# Altium schematic sheet CONTROLADOR-V1-CPU.SchDoc
size A4
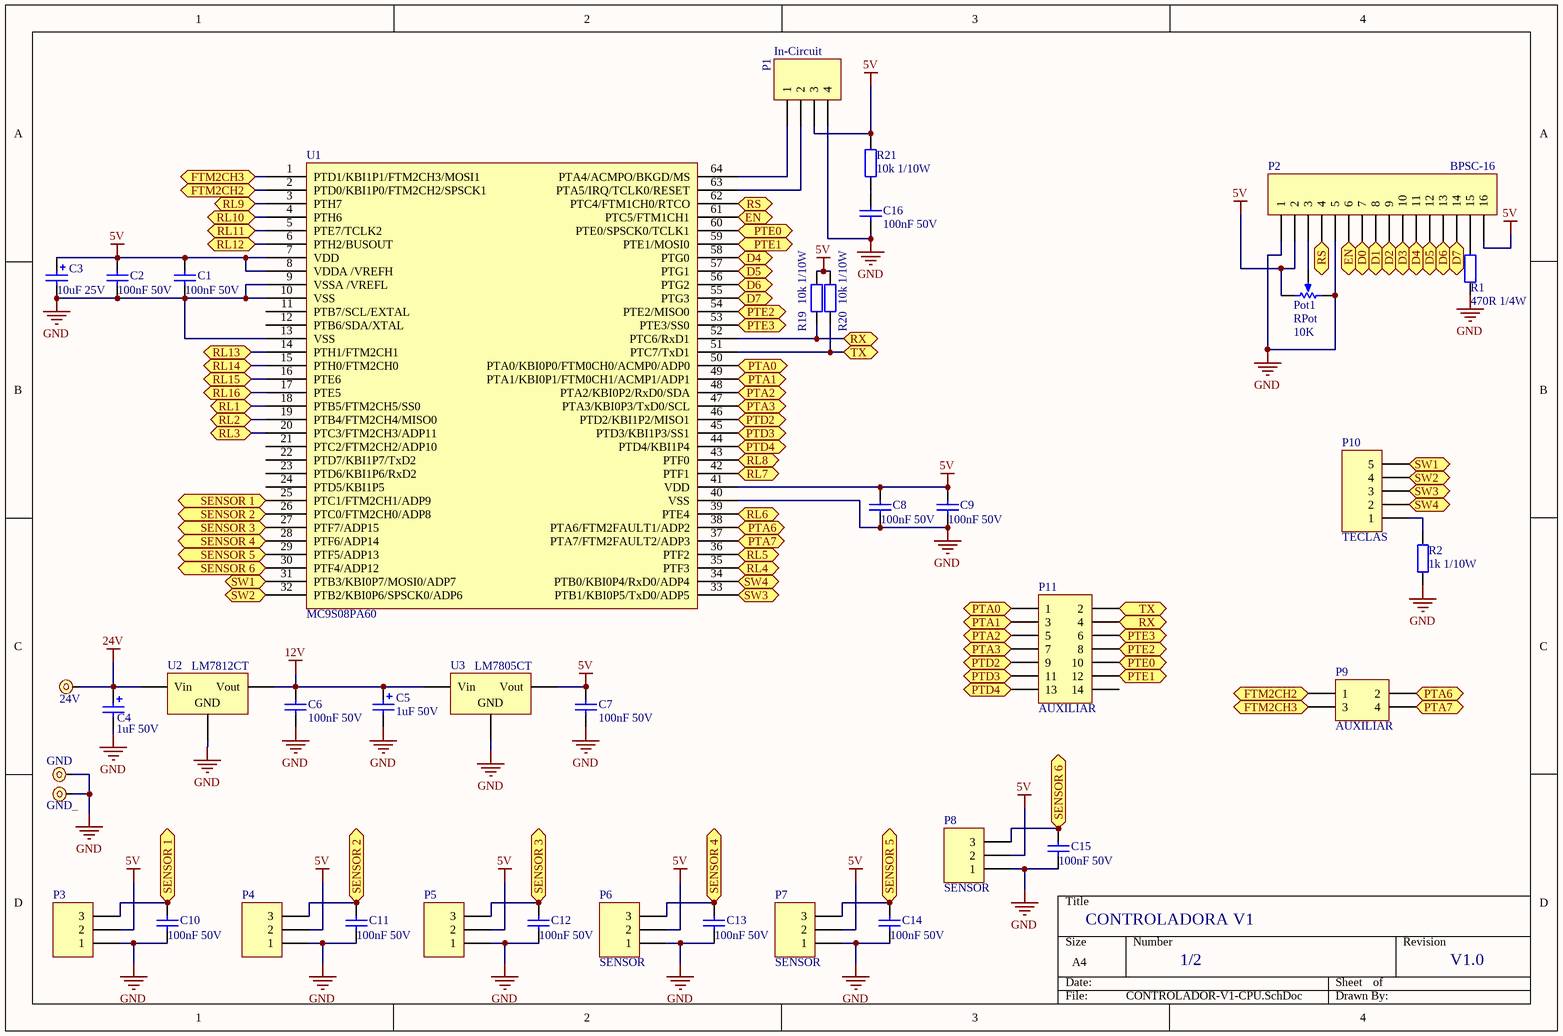
[diagram p0: CONTROLADOR-V1-CPU.SchDoc]

## Parts
24V  PAD 1.5x3mm  [PAD 1.5x3mm]  (value not drawn)  (no BOM)
C1  100nF 50V  [CAPC0603N]
C2  100nF 50V  [CAPC0603N]
C3  10uF 25V  [CAP_ELETR_4X5.4 SMD]
C4  1uF 50V  [CAP_ELETR_4X5.4 SMD]
C5  1uF 50V  [CAP_ELETR_4X5.4 SMD]
C6  100nF 50V  [CAPC0603N]
C7  100nF 50V  [CAPC0603N]
C8  100nF 50V  [CAPC0603N]
C9  100nF 50V  [CAPC0603N]
C10  100nF 50V  [CAPC0603N]
C11  100nF 50V  [CAPC0603N]
C12  100nF 50V  [CAPC0603N]
C13  100nF 50V  [CAPC0603N]
C14  100nF 50V  [CAPC0603N]
C15  100nF 50V  [CAPC0603N]
C16  100nF 50V  [CAPC0603N]
GND  PAD 1.5x3mm  [PAD 1.5x3mm]  (value not drawn)  (no BOM)
GND_  PAD 1.5x3mm  [PAD 1.5x3mm]  (value not drawn)  (no BOM)
P1  In-Circuit  [HEADER 4X2.54MM]
P2  BPSC-16  [BPSC-16]
P3  SENSOR  [HEADER 3X2.54MM]  (value not drawn)
P4  SENSOR  [HEADER 3X2.54MM]  (value not drawn)
P5  SENSOR  [HEADER 3X2.54MM]  (value not drawn)
P6  SENSOR  [HEADER 3X2.54MM]
P7  SENSOR  [HEADER 3X2.54MM]
P8  SENSOR  [HEADER 3X2.54MM]
P9  AUXILIAR  [HDR2X2]
P10  TECLAS  [BPSC-5]
P11  AUXILIAR  [HDR2X7]
Pot1  RPot  value 10K  [VR5]
R1  470R 1/4W  [RESC1206N]
R2  1k 1/10W  [RESC0603N]
R19  10k 1/10W  [RESC0603N]
R20  10k 1/10W  [RESC0603N]
R21  10k 1/10W  [RESC0603N]
U1  MC9S08PA60  [LQFP64]
U2  LM7812CT  [TO220_90]
U3  LM7805CT  [TO220_90]

## Ports
D0, D1, D2, D3, D4, D5, D6, D7, EN, FTM2CH2, FTM2CH3, PTA0, PTA1, PTA2, PTA3, PTA6, PTA7, PTD2, PTD3, PTD4, PTE0, PTE1, PTE2, PTE3, RL1, RL2, RL3, RL4, RL5, RL6, RL7, RL8, RL9, RL10, RL11, RL12, RL13, RL14, RL15, RL16, RS, RX, SENSOR 1, SENSOR 2, SENSOR 3, SENSOR 4, SENSOR 5, SENSOR 6, SW1, SW2, SW3, SW4, TX

## Nets
5V: C1.2 C2.2 C3.1 C7.2 C8.2 C9.2 P1.3 P2.2 P2.16 P3.2 P4.2 P5.2 P6.2 P7.2 P8.2 Pot1.2(BOT) R19.1 R20.1 R21.2 U1.7(VDD) U1.8(VDDA_/VREFH) U1.41(VDD) U3.3(Vout)
12V: C5.1 C6.2 U2.3(Vout) U3.1(Vin)
24V: 24V.1 C4.1 U2.1(Vin)
GND: C1.1 C2.1 C3.2 C4.2 C5.2 C6.1 C7.1 C8.1 C9.1 C10.1 C11.1 C12.1 C13.1 C14.1 C15.1 C16.2 GND.1 GND_.1 P1.4 P2.1 P2.5 P3.1 P4.1 P5.1 P6.1 P7.1 P8.1 Pot1.1(TOP) R1.1 R2.1 U1.9(VSSA_/VREFL) U1.10(VSS) U1.13(VSS) U1.40(VSS) U2.2(GND) U3.2(GND)
D0: P2.7 ; port D0
D1: P2.8 ; port D1
D2: P2.9 ; port D2
D3: P2.10 ; port D3
D4: P2.11 U1.58(PTG0) ; port D4
D5: P2.12 U1.57(PTG1) ; port D5
D6: P2.13 U1.56(PTG2) ; port D6
D7: P2.14 U1.55(PTG3) ; port D7
EN: P2.6 U1.61(PTC5/FTM1CH1) ; port EN
FTM2CH2: P9.1 U1.2(PTD0/KBI1P0/FTM2CH2/SPSCK1) ; port FTM2CH2
FTM2CH3: P9.3 U1.1(PTD1/KBI1P1/FTM2CH3/MOSI1) ; port FTM2CH3
PTA0: P11.1 U1.50(PTA0/KBI0P0/FTM0CH0/ACMP0/ADP0) ; port PTA0
PTA1: P11.3 U1.49(PTA1/KBI0P1/FTM0CH1/ACMP1/ADP1) ; port PTA1
PTA2: P11.5 U1.48(PTA2/KBI0P2/RxD0/SDA) ; port PTA2
PTA3: P11.7 U1.47(PTA3/KBI0P3/TxD0/SCL) ; port PTA3
PTA6: P9.2 U1.38(PTA6/FTM2FAULT1/ADP2) ; port PTA6
PTA7: P9.4 U1.37(PTA7/FTM2FAULT2/ADP3) ; port PTA7
PTD2: P11.9 U1.46(PTD2/KBI1P2/MISO1) ; port PTD2
PTD3: P11.11 U1.45(PTD3/KBI1P3/SS1) ; port PTD3
PTD4: P11.13 U1.44(PTD4/KBI1P4) ; port PTD4
PTE0: P11.10 U1.60(PTE0/SPSCK0/TCLK1) ; port PTE0
PTE1: P11.12 U1.59(PTE1/MOSI0) ; port PTE1
PTE2: P11.8 U1.54(PTE2/MISO0) ; port PTE2
PTE3: P11.6 U1.53(PTE3/SS0) ; port PTE3
RL1: U1.18(PTB5/FTM2CH5/SS0) ; port RL1
RL2: U1.19(PTB4/FTM2CH4/MISO0) ; port RL2
RL3: U1.20(PTC3/FTM2CH3/ADP11) ; port RL3
RL4: U1.35(PTF3) ; port RL4
RL5: U1.36(PTF2) ; port RL5
RL6: U1.39(PTE4) ; port RL6
RL7: U1.42(PTF1) ; port RL7
RL8: U1.43(PTF0) ; port RL8
RL9: U1.3(PTH7) ; port RL9
RL10: U1.4(PTH6) ; port RL10
RL11: U1.5(PTE7/TCLK2) ; port RL11
RL12: U1.6(PTH2/BUSOUT) ; port RL12
RL13: U1.14(PTH1/FTM2CH1) ; port RL13
RL14: U1.15(PTH0/FTM2CH0) ; port RL14
RL15: U1.16(PTE6) ; port RL15
RL16: U1.17(PTE5) ; port RL16
RS: P2.4 U1.62(PTC4/FTM1CH0/RTCO) ; port RS
RX: P11.4 R19.2 U1.52(PTC6/RxD1) ; port RX
SENSOR 1: C10.2 P3.3 U1.25(PTC1/FTM2CH1/ADP9) ; port SENSOR 1
SENSOR 2: C11.2 P4.3 U1.26(PTC0/FTM2CH0/ADP8) ; port SENSOR 2
SENSOR 3: C12.2 P5.3 U1.27(PTF7/ADP15) ; port SENSOR 3
SENSOR 4: C13.2 P6.3 U1.28(PTF6/ADP14) ; port SENSOR 4
SENSOR 5: C14.2 P7.3 U1.29(PTF5/ADP13) ; port SENSOR 5
SENSOR 6: C15.2 P8.3 U1.30(PTF4/ADP12) ; port SENSOR 6
SW1: P10.5 U1.31(PTB3/KBI0P7/MOSI0/ADP7) ; port SW1
SW2: P10.4 U1.32(PTB2/KBI0P6/SPSCK0/ADP6) ; port SW2
SW3: P10.3 U1.33(PTB1/KBI0P5/TxD0/ADP5) ; port SW3
SW4: P10.2 U1.34(PTB0/KBI0P4/RxD0/ADP4) ; port SW4
TX: P11.2 R20.2 U1.51(PTC7/TxD1) ; port TX
NetC16_1: C16.1 R21.1
NetP1_1: P1.1 U1.64(PTA4/ACMPO/BKGD/MS)
NetP1_2: P1.2 U1.63(PTA5/IRQ/TCLK0/RESET)
NetP2_3: P2.3 Pot1.3(TAP)
NetP2_15: P2.15 R1.2
NetP10_1: P10.1 R2.2

Not connected (* = marked no-connect by the designer): P11 14; U1 11(PTB7/SCL/EXTAL) 12(PTB6/SDA/XTAL) 21(PTC2/FTM2CH2/ADP10) 22(PTD7/KBI1P7/TxD2) 23(PTD6/KBI1P6/RxD2) 24(PTD5/KBI1P5)

## Notes on the sheet
- CONTROLADORA V1
- 1/2
- V1.0

## Library data of the parts
24V GND GND_ = PAD 1.5x3mm: PAD
C1 C2 C6-C16 = Cap 100nF 50V 0603: CAP CER 0.1UF 50V X7R 0603; Manufacturer: Samsung Electro-Mechanics America, Inc.; Manufacturer Part Number: CL10B104KB8NNNC; Código: 1766; Montagem: SMD; Tolerance: ±10%; Supplier 1: Digi-Key; Supplier Part Number 1: 1276-1000-1-ND; RoHS: RoHS Compliant; Category: Capacitors; Stock 1: 3548129; Pricing 1: 1=0.1, 10=0.027, 100=0.0122, 500=0.00874, 1000=0.00687 (USD); Packaging: Cut Tape (CT); Part Status: Active; Voltage - Rated: 50V; Temperature Coefficient: X7R; Operating Temperature: -55°C ~ 125°C; Features: -; Ratings: -; Applications: General Purpose; Mounting Type: Surface Mount, MLCC; Package / Case: 0603 (1608 Metric); Size / Dimension: 0.063" L x 0.032" W (1.60mm x 0.80mm); Height - Seated (Max): -; Thickness (Max): 0.035" (0.90mm); Lead Spacing: -; Lead Style: -; ComponentLink1URL: http://media.digikey.com/pdf/Data%20Sheets/Samsung%20PDFs/CL_Series_MLCC_ds.pdf; ComponentLink1Description: http://media.digikey.com/pdf/Data%20Sheets/Samsung%20PDFs/CL_Series_MLCC_ds.pdf
C3 = Cap Eletrolitico 10uF 25V: CAP ALUM 10UF 20% 25V SMD; Manufacturer: Panasonic Electronic Components; Manufacturer Part Number: EEE-1EA100WR; Código: 2170; Lifetime @ Temp.: 1000 Hrs @ 85°C; Polarization: Polar; Ripple Current - Low Frequency: 22mA @ 120Hz; Ripple Current - High Frequency: 37.4mA @ 10kHz; Surface Mount Land Size: 0.169" L x 0.169" W (4.30mm x 4.30mm); Montagem: SMD; Supplier 1: Digi-Key; Supplier Part Number 1: PCE3895CT-ND; RoHS: RoHS Compliant; Category: Capacitors; Stock 1: 101827; Pricing 1: 1=0.31, 10=0.21, 100=0.1191, 500=0.08404, 1000=0.07354 (USD); Packaging: Cut Tape (CT); Part Status: Active; Tolerance: ±20%; ESR (Equivalent Series Resistance): -; Operating Temperature: -40°C ~ 85°C; Applications: General Purpose; Lead Spacing: -; Size / Dimension: 0.157" Dia (4.00mm); Height - Seated (Max): 0.213" (5.40mm); Mounting Type: Surface Mount; Package / Case: Radial, Can - SMD; ComponentLink1URL: https://industrial.panasonic.com/cdbs/www-data/pdf/RDE0000/ABA0000C1145.pdf; ComponentLink1Description: https://industrial.panasonic.com/cdbs/www-data/pdf/RDE0000/ABA0000C1145.pdf
C4 C5 = Cap Eletrolitico 1uF 50V: CAP ALUM 1UF 20% 50V SMD; Manufacturer: Panasonic Electronic Components; Manufacturer Part Number: EEE-HA1H1R0R; Lifetime @ Temp.: 1000 Hrs @ 105°C; Polarization: Polar; Ripple Current - Low Frequency: 10mA @ 120Hz; Ripple Current - High Frequency: 17mA @ 10kHz; Surface Mount Land Size: 0.169" L x 0.169" W (4.30mm x 4.30mm); Montagem: SMD; Supplier 1: Digi-Key; Supplier Part Number 1: PCE4212CT-ND; RoHS: RoHS Compliant; Category: Capacitors; Stock 1: 21464; Pricing 1: 1=0.32, 10=0.217, 100=0.1232, 500=0.08694, 1000=0.07607 (USD); Packaging: Cut Tape (CT); Part Status: Active; Tolerance: ±20%; ESR (Equivalent Series Resistance): -; Operating Temperature: -40°C ~ 105°C; Applications: Automotive; Lead Spacing: -; Size / Dimension: 0.157" Dia (4.00mm); Height - Seated (Max): 0.213" (5.40mm); Mounting Type: Surface Mount; Package / Case: Radial, Can - SMD; ComponentLink1URL: https://industrial.panasonic.com/cdbs/www-data/pdf/RDE0000/ABA0000C1151.pdf; ComponentLink1Description: https://industrial.panasonic.com/cdbs/www-data/pdf/RDE0000/ABA0000C1151.pdf
P1 = Barra de pinos simples 180°, 4 pinos: CONN HEADER 4 POS 2.54; Manufacturer: Metaltex; Manufacturer Part Number: BPSC-4; Código: 2308; Montagem: PTH; Pitch - Mating: 0.100" (2.54mm); Style: Board to Board or Cable; Shrouding: Unshrouded; Number of Positions: 4; Number of Positions Loaded: All; Contact Length - Mating: 0.236" (6.00mm); Contact Length - Post: 0.118" (3.00mm); Overall Contact Length: 0.454" (11.54mm); Material Flammability Rating: UL94 V-0; Current Rating: 3A; Voltage Rating: 250V; Supplier 1: Digi-Key; Supplier Part Number 1: 732-5317-ND; RoHS: RoHS Compliant; Category: Connectors, Interconnects; Stock 1: 2640; Pricing 1: 1=0.18, 10=0.153, 25=0.1272, 50=0.106, 100=0.096, 1000=0.088 (USD); Packaging: Bulk; Part Status: Active; Connector Type: Header; Contact Type: Male Pin; Number of Rows: 1; Row Spacing - Mating: -; Mounting Type: Through Hole; Termination: Solder; Fastening Type: Push-Pull; Insulation Height: 0.100" (2.54mm); Contact Shape: Square; Contact Finish - Mating: Gold; Contact Finish Thickness - Mating: -; Contact Finish - Post: -; Contact Material: Copper Alloy; Insulation Material: Polybutylene Terephthalate (PBT); Features: -; Operating Temperature: -40°C ~ 125°C; Ingress Protection: -; Insulation Color: Black; Mated Stacking Heights: -; Contact Finish Thickness - Post: -; Applications: -; ComponentLink1URL: http://www.metaltex.com.br/produtos/componentes/4091/conectores_para_pci/4094/bp_barra_de_pinos; ComponentLink1Description: http://www.metaltex.com.br/produtos/componentes/4091/conectores_para_pci/4094/bp_barra_de_pinos
P2 = Barra de pinos simples 180º, 16 pinos: CONN HEADER 16POS 2.54MM VERT; Manufacturer: Molex Inc; Manufacturer Part Number: 0022284160; Connector Type: Header, Unshrouded, Breakaway; Number of Positions: 16; Number of Positions Loaded: All; Pitch: 0.100" (2.54mm); Supplier 1: Digi-Key; Supplier Part Number 1: WM50014-16-ND; RoHS: RoHS Compliant; Category: Connectors, Interconnects; Stock 1: 0; Pricing 1: 1=0.52, 10=0.461, 100=0.3797, 500=0.30012, 1000=0.25763, 5000=0.23503, 10000=0.22599 (USD); Packaging: Bulk; Contact Type: Male Pin; Number of Rows: 1; Row Spacing: -; Contact Mating Length: 0.240" (6.10mm); Mounting Type: Through Hole; Termination: Solder; Fastening Type: -; Features: -; Contact Finish: Tin; Contact Finish Thickness: 100µin (2.54µm); Color: Black; ComponentLink1URL: http://www.molex.com/pdm_docs/sd/022284160_sd.pdf; ComponentLink1Description: http://www.molex.com/pdm_docs/sd/022284160_sd.pdf
P3-P8 = Barra de pinos simples 180°, 3 pinos: CONN HEADER 3 POS 2.54; Manufacturer: Metaltex; Manufacturer Part Number: BPSC-3; Código: 2307; Montagem: PTH; Pitch - Mating: 0.100" (2.54mm); Style: Board to Board or Cable; Shrouding: Unshrouded; Number of Positions: 3; Number of Positions Loaded: All; Contact Length - Mating: 0.236" (6.00mm); Contact Length - Post: 0.118" (3.00mm); Overall Contact Length: 0.454" (11.54mm); Material Flammability Rating: UL94 V-0; Current Rating: 3A; Voltage Rating: 250V; Supplier 1: Digi-Key; Supplier Part Number 1: 732-5316-ND; RoHS: RoHS Compliant; Category: Connectors, Interconnects; Stock 1: 2640; Pricing 1: 1=0.18, 10=0.153, 25=0.1272, 50=0.106, 100=0.096, 1000=0.088 (USD); Packaging: Bulk; Part Status: Active; Connector Type: Header; Contact Type: Male Pin; Number of Rows: 1; Row Spacing - Mating: -; Mounting Type: Through Hole; Termination: Solder; Fastening Type: Push-Pull; Insulation Height: 0.100" (2.54mm); Contact Shape: Square; Contact Finish - Mating: Gold; Contact Finish Thickness - Mating: -; Contact Finish - Post: -; Contact Material: Copper Alloy; Insulation Material: Polybutylene Terephthalate (PBT); Features: -; Operating Temperature: -40°C ~ 125°C; Ingress Protection: -; Insulation Color: Black; Mated Stacking Heights: -; Contact Finish Thickness - Post: -; Applications: -; ComponentLink1URL: http://www.metaltex.com.br/produtos/componentes/4091/conectores_para_pci/4094/bp_barra_de_pinos; ComponentLink1Description: http://www.metaltex.com.br/produtos/componentes/4091/conectores_para_pci/4094/bp_barra_de_pinos
P9 = Header 2X2: Header, 2-Pin, Dual row; LatestRevisionDate: 17-Jul-2002; LatestRevisionNote: Re-released for DXP Platform.; Publisher: Altium Limited
P10 = Barra de pinos simples 180º, 5 pinos: CONN HEADER 5POS 2.54MM VERT; Manufacturer: Molex Inc; Manufacturer Part Number: 0022284050; Connector Type: Header, Unshrouded, Breakaway; Number of Positions: 5; Number of Positions Loaded: All; Pitch: 0.100" (2.54mm); Supplier 1: Digi-Key; Supplier Part Number 1: WM50014-05-ND; RoHS: RoHS Compliant; Category: Connectors, Interconnects; Stock 1: 0; Pricing 1: 1=0.27, 10=0.24, 100=0.1976, 500=0.15622, 1000=0.13411, 5000=0.12234, 10000=0.11764 (USD); Packaging: Bulk; Contact Type: Male Pin; Number of Rows: 1; Row Spacing: -; Contact Mating Length: 0.240" (6.10mm); Mounting Type: Through Hole; Termination: Solder; Fastening Type: -; Features: -; Contact Finish: Tin; Contact Finish Thickness: 100µin (2.54µm); Color: Black; ComponentLink1URL: http://www.molex.com/pdm_docs/sd/022284050_sd.pdf; ComponentLink1Description: http://www.molex.com/pdm_docs/sd/022284050_sd.pdf
P11 = Header 7X2: Header, 7-Pin, Dual row; LatestRevisionDate: 17-Jul-2002; LatestRevisionNote: Re-released for DXP Platform.; Publisher: Altium Limited
Pot1 = RPot: Potentiometer; Sim Note: Enter the Resistance value and the set point into parameter fields.; Set Position: 0.5; Published: 8-Jun-2000; LatestRevisionDate: 17-Jul-2002; LatestRevisionNote: Re-released for DXP Platform.; PackageReference: VR5; Publisher: Altium Limited; PackageDescription: Variable Resistor, Thru-Hole; 3 Leads
R1 = Res 470R 1/4W 5% 1206: RES SMD 470 OHM 5% 1/4W 1206; Manufacturer: Stackpole Electronics Inc.; Manufacturer Part Number: RMCF1206JT470R; Código: 2021; Power (Watts): 0.25W, 1/4W; Temperature Coefficient: ±200ppm/°C; Montagem: SMD; Supplier 1: Digi-Key; Supplier Part Number 1: RMCF1206JT470RCT-ND; RoHS: RoHS Compliant; Category: Resistors; Stock 1: 392377; Pricing 1: 1=0.1, 10=0.026, 100=0.0108, 1000=0.00484, 2500=0.0042 (USD); Packaging: Cut Tape (CT); Part Status: Active; Tolerance: ±5%; Composition: Thick Film; Features: Automotive AEC-Q200; Operating Temperature: -55°C ~ 155°C; Package / Case: 1206 (3216 Metric); Supplier Device Package: 1206; Size / Dimension: 0.126" L x 0.063" W (3.20mm x 1.60mm); Height - Seated (Max): 0.028" (0.70mm); Failure Rate: -; ComponentLink1URL: https://www.seielect.com/Catalog/SEI-RMCF_RMCP.pdf; ComponentLink1Description: https://www.seielect.com/Catalog/SEI-RMCF_RMCP.pdf
R2 = Res 1k 1/10W 5% 0603: RES SMD 1K OHM 5% 1/10W 0603; Manufacturer: Stackpole Electronics Inc.; Manufacturer Part Number: RMCF0603JT1K00; Código: 2537; Power (Watts): 0.1W, 1/10W; Temperature Coefficient: ±200ppm/°C; Montagem: SMD; Supplier 1: Digi-Key; Supplier Part Number 1: RMCF0603JT1K00CT-ND; RoHS: RoHS Compliant; Category: Resistors; Stock 1: 323501; Pricing 1: 1=0.1, 10=0.013, 100=0.0054, 1000=0.00242, 2500=0.0021 (USD); Packaging: Cut Tape (CT); Part Status: Active; Tolerance: ±5%; Composition: Thick Film; Features: Automotive AEC-Q200; Operating Temperature: -55°C ~ 155°C; Package / Case: 0603 (1608 Metric); Supplier Device Package: 0603; Size / Dimension: 0.061" L x 0.031" W (1.55mm x 0.80mm); Height - Seated (Max): 0.022" (0.55mm); Failure Rate: -; ComponentLink1URL: https://www.seielect.com/Catalog/SEI-RMCF_RMCP.pdf; ComponentLink1Description: https://www.seielect.com/Catalog/SEI-RMCF_RMCP.pdf
R19-R21 = Res 10k 1/10W 5% 0603: RES SMD 10K OHM 5% 1/10W 0603; Manufacturer: Stackpole Electronics Inc.; Manufacturer Part Number: RMCF0603JT10K0; Código: 1772; Power (Watts): 0.1W, 1/10W; Temperature Coefficient: ±200ppm/°C; Montagem: SMD; Supplier 1: Digi-Key; Supplier Part Number 1: RMCF0603JT10K0CT-ND; RoHS: RoHS Compliant; Category: Resistors; Stock 1: 969403; Pricing 1: 1=0.1, 10=0.013, 100=0.0054, 1000=0.00242, 2500=0.0021 (USD); Packaging: Cut Tape (CT); Part Status: Active; Tolerance: ±5%; Composition: Thick Film; Features: Automotive AEC-Q200; Operating Temperature: -55°C ~ 155°C; Package / Case: 0603 (1608 Metric); Supplier Device Package: 0603; Size / Dimension: 0.061" L x 0.031" W (1.55mm x 0.80mm); Height - Seated (Max): 0.022" (0.55mm); Failure Rate: -; ComponentLink1URL: https://www.seielect.com/Catalog/SEI-RMCF_RMCP.pdf; ComponentLink1Description: https://www.seielect.com/Catalog/SEI-RMCF_RMCP.pdf
U1 = Microcontrolador MC9S08PA60AVLC: IC MCU 8BIT 60KB FLASH 64LQFP
U2 U3 = Regulador de tensão LM7805CT: IC REG LINEAR 5V 1A TO220-3; Manufacturer: Texas Instruments; Manufacturer Part Number: LM7805CT/NOPB; Código: 329; Montagem: PTH; Output Configuration: Positive; Output Type: Fixed; Voltage - Input (Max): 35V; Voltage Dropout (Max): 2V @ 1A; PSRR: 80dB (120Hz); Protection Features: Over Current, Over Temperature, Short Circuit; Supplier 1: Digi-Key; Supplier Part Number 1: 296-47192-ND; RoHS: RoHS Compliant; Category: Integrated Circuits (ICs); Stock 1: 304; Pricing 1: 1=1.54, 10=1.381, 100=1.1097, 500=0.91176, 1000=0.75545 (USD); Packaging: Tube; Part Status: Active; Voltage - Output (Min/Fixed): 5V; Voltage - Output (Max): -; Current - Output: 1A; Control Features: -; Operating Temperature: 0°C ~ 125°C; Mounting Type: Through Hole; Package / Case: TO-220-3; Supplier Device Package: TO-220-3; ComponentLink1URL: http://www.ti.com/lit/ds/symlink/lm340.pdf; ComponentLink1Description: http://www.ti.com/lit/ds/symlink/lm340.pdf